# EAGLE design four-meters-usb-c-three-page (EAGLE 7.7.0)

## Sheet 1 of 3
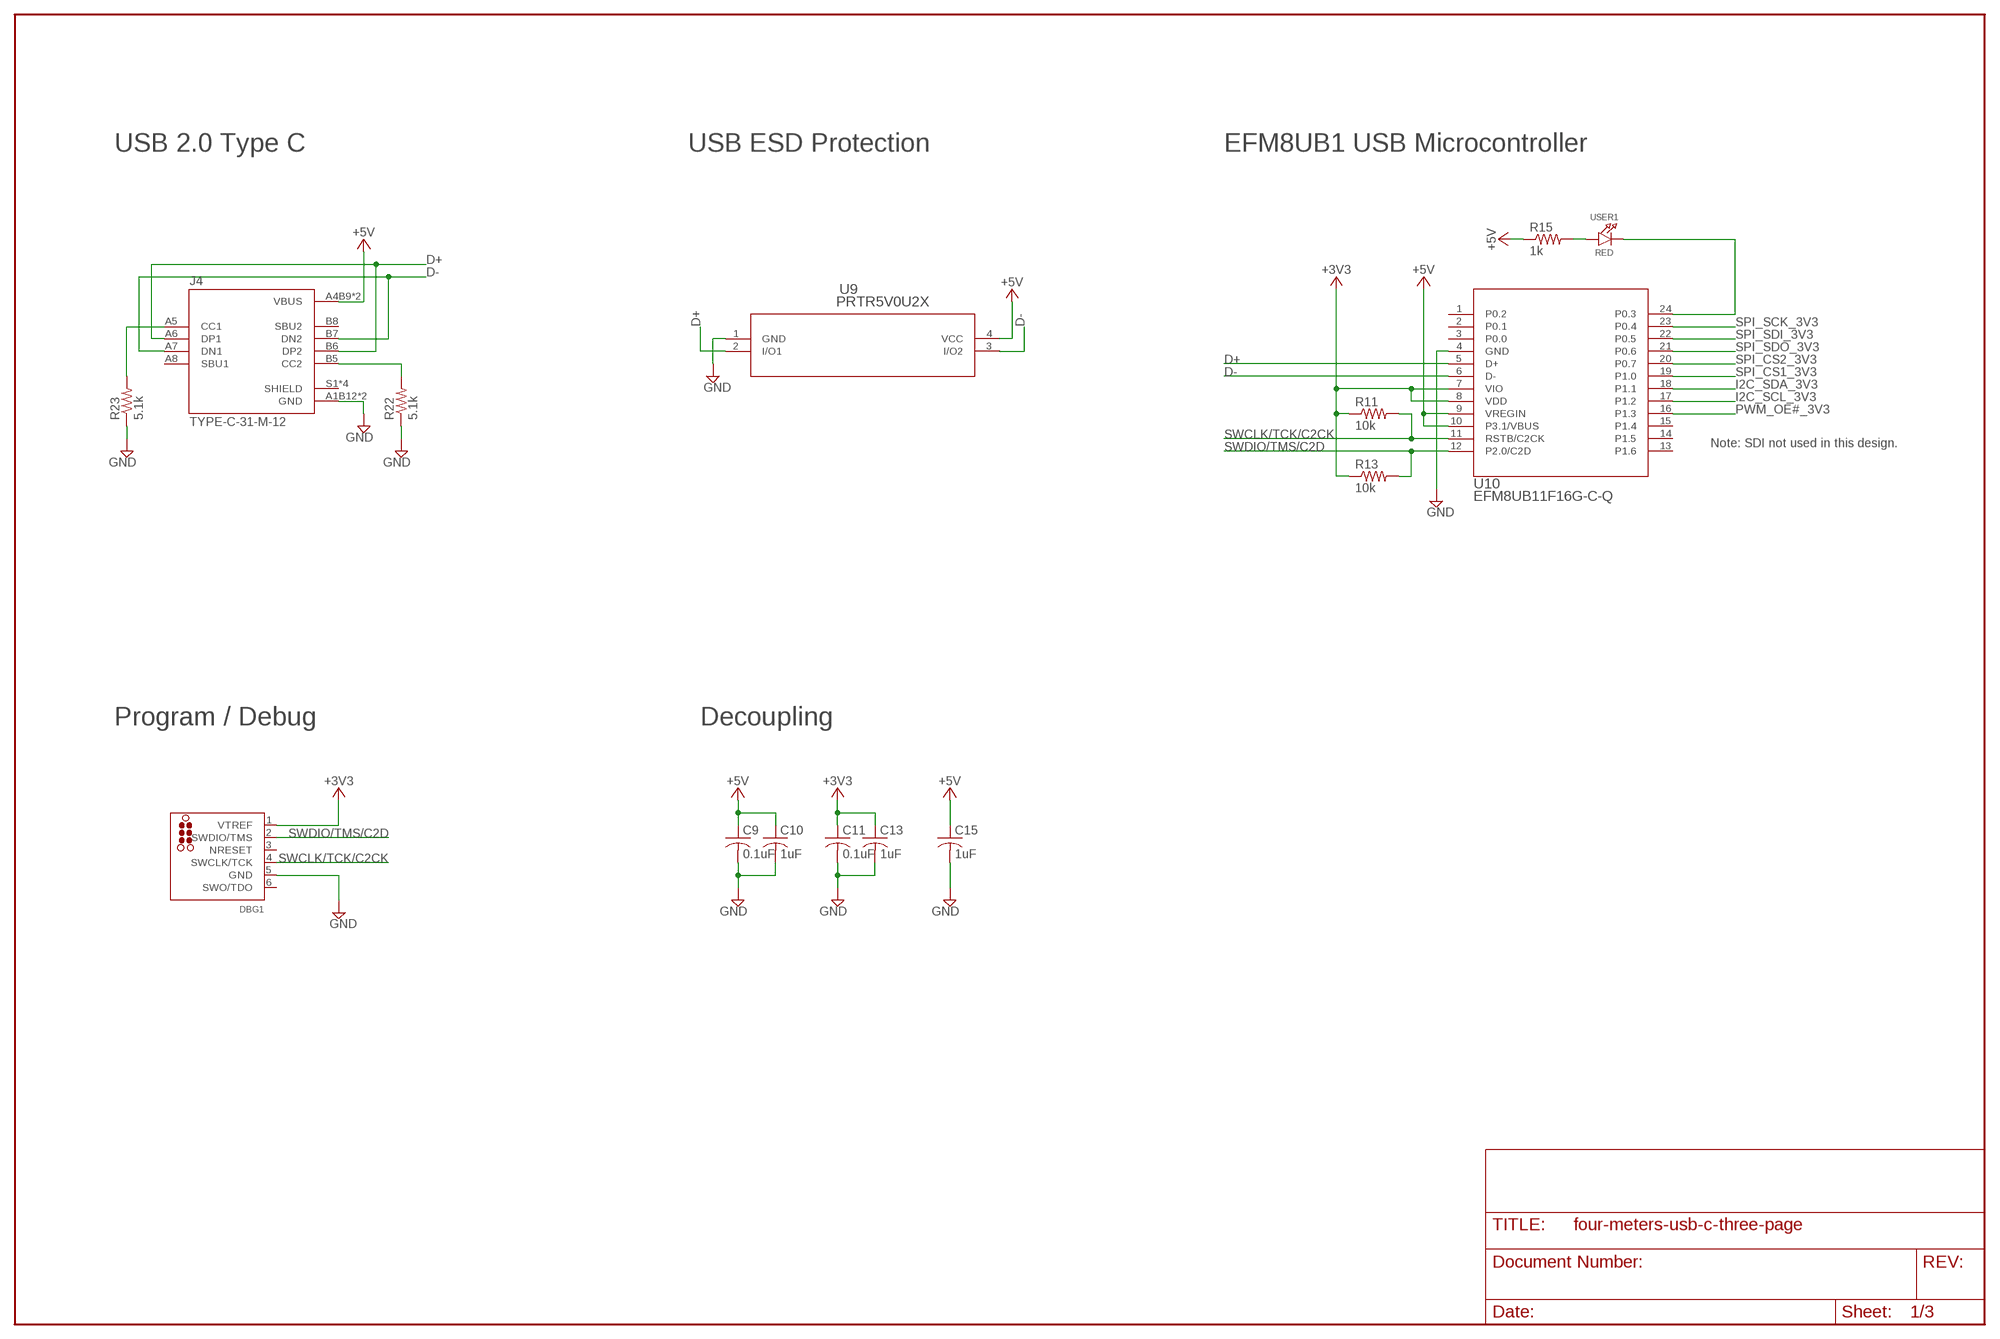
[diagram p0: schematic, sheet 1]

### Parts
C9  0.1uF  C-USC0603  [C0603]
C10  1uF  C-USC0603  [C0603]
C11  0.1uF  C-USC0603  [C0603]
C13  1uF  C-USC0603  [C0603]
C15  1uF  C-USC1210K  [C1210K]
DBG1  TC2030-CTX-SWD  [TC2030-MCP-NL]
J4  TYPE-C-31-M-12  [HRO_TYPE-C-31-M-12]
R11  10k  R-US_R0603  [R0603]
R13  10k  R-US_R0603  [R0603]
R15  1k  R-US_R0603  [R0603]
R22  5.1k  R-US_R0603  [R0603]
R23  5.1k  R-US_R0603  [R0603]
U9  PRTR5V0U2X  [SOT143B]
U10  EFM8UB11F16G-C-Q  [QSOP24]
USER1  RED  LED0805_NOOUTLINE  [CHIPLED_0805_NOOUTLINE]

### Nets
+3V3: C11.1 C13.1 DBG1.1(VTREF) R11.1 R13.1 U10.7(VIO) U10.8(VDD) ; also sheet 2,3
+5V: C9.1 C10.1 C15.1 J4.A4B9(VBUS) J4.B4A9(VBUS) R15.1 U9.4(VCC) U10.9(VREGIN) U10.10(P3.1/VBUS) ; also sheet 2,3
D+: J4.A6(DP1) J4.B6(DP2) U9.2(I/O1) U10.5(D+)
D-: J4.A7(DN1) J4.B7(DN2) U9.3(I/O2) U10.6(D-)
GND: C9.2 C10.2 C11.2 C13.2 C15.2 DBG1.5(GND) J4.A1B12(GND) J4.B1A12(GND) R22.1 R23.1 U9.1(GND) U10.4(GND) ; also sheet 2,3
I2C_SCL_3V3: U10.17(P1.2) ; also sheet 3
I2C_SDA_3V3: U10.18(P1.1) ; also sheet 3
LED1: U10.24(P0.3) USER1.C
N$17: R15.2 USER1.A
N$18: J4.B5(CC2) R22.2
N$19: J4.A5(CC1) R23.2
PWM_OE#_3V3: U10.16(P1.3) ; also sheet 3
SPI_CS1_3V3: U10.19(P1.0) ; also sheet 2
SPI_CS2_3V3: U10.20(P0.7) ; also sheet 2
SPI_SCK_3V3: U10.23(P0.4) ; also sheet 2
SPI_SDI_3V3: U10.22(P0.5)
SPI_SDO_3V3: U10.21(P0.6) ; also sheet 2
SWCLK/TCK/C2CK: DBG1.4(SWCLK/TCK) R11.2 U10.11(RSTB/C2CK)
SWDIO/TMS/C2D: DBG1.2(SWDIO/TMS) R13.2 U10.12(P2.0/C2D)
Unconnected: DBG1.6(SWO/TDO) J4.A8(SBU1) J4.B8(SBU2) J4.S1(SHIELD) J4.S2(SHIELD) J4.S3(SHIELD) J4.S4(SHIELD) U10.1(P0.2) U10.2(P0.1) U10.3(P0.0) U10.13(P1.6) U10.14(P1.5) U10.15(P1.4)

### Notes on the sheet
- USB 2.0 Type C | USB ESD Protection | EFM8UB1 USB Microcontroller
- Note: SDI not used in this design.
- Program / Debug | Decoupling

## Sheet 2 of 3
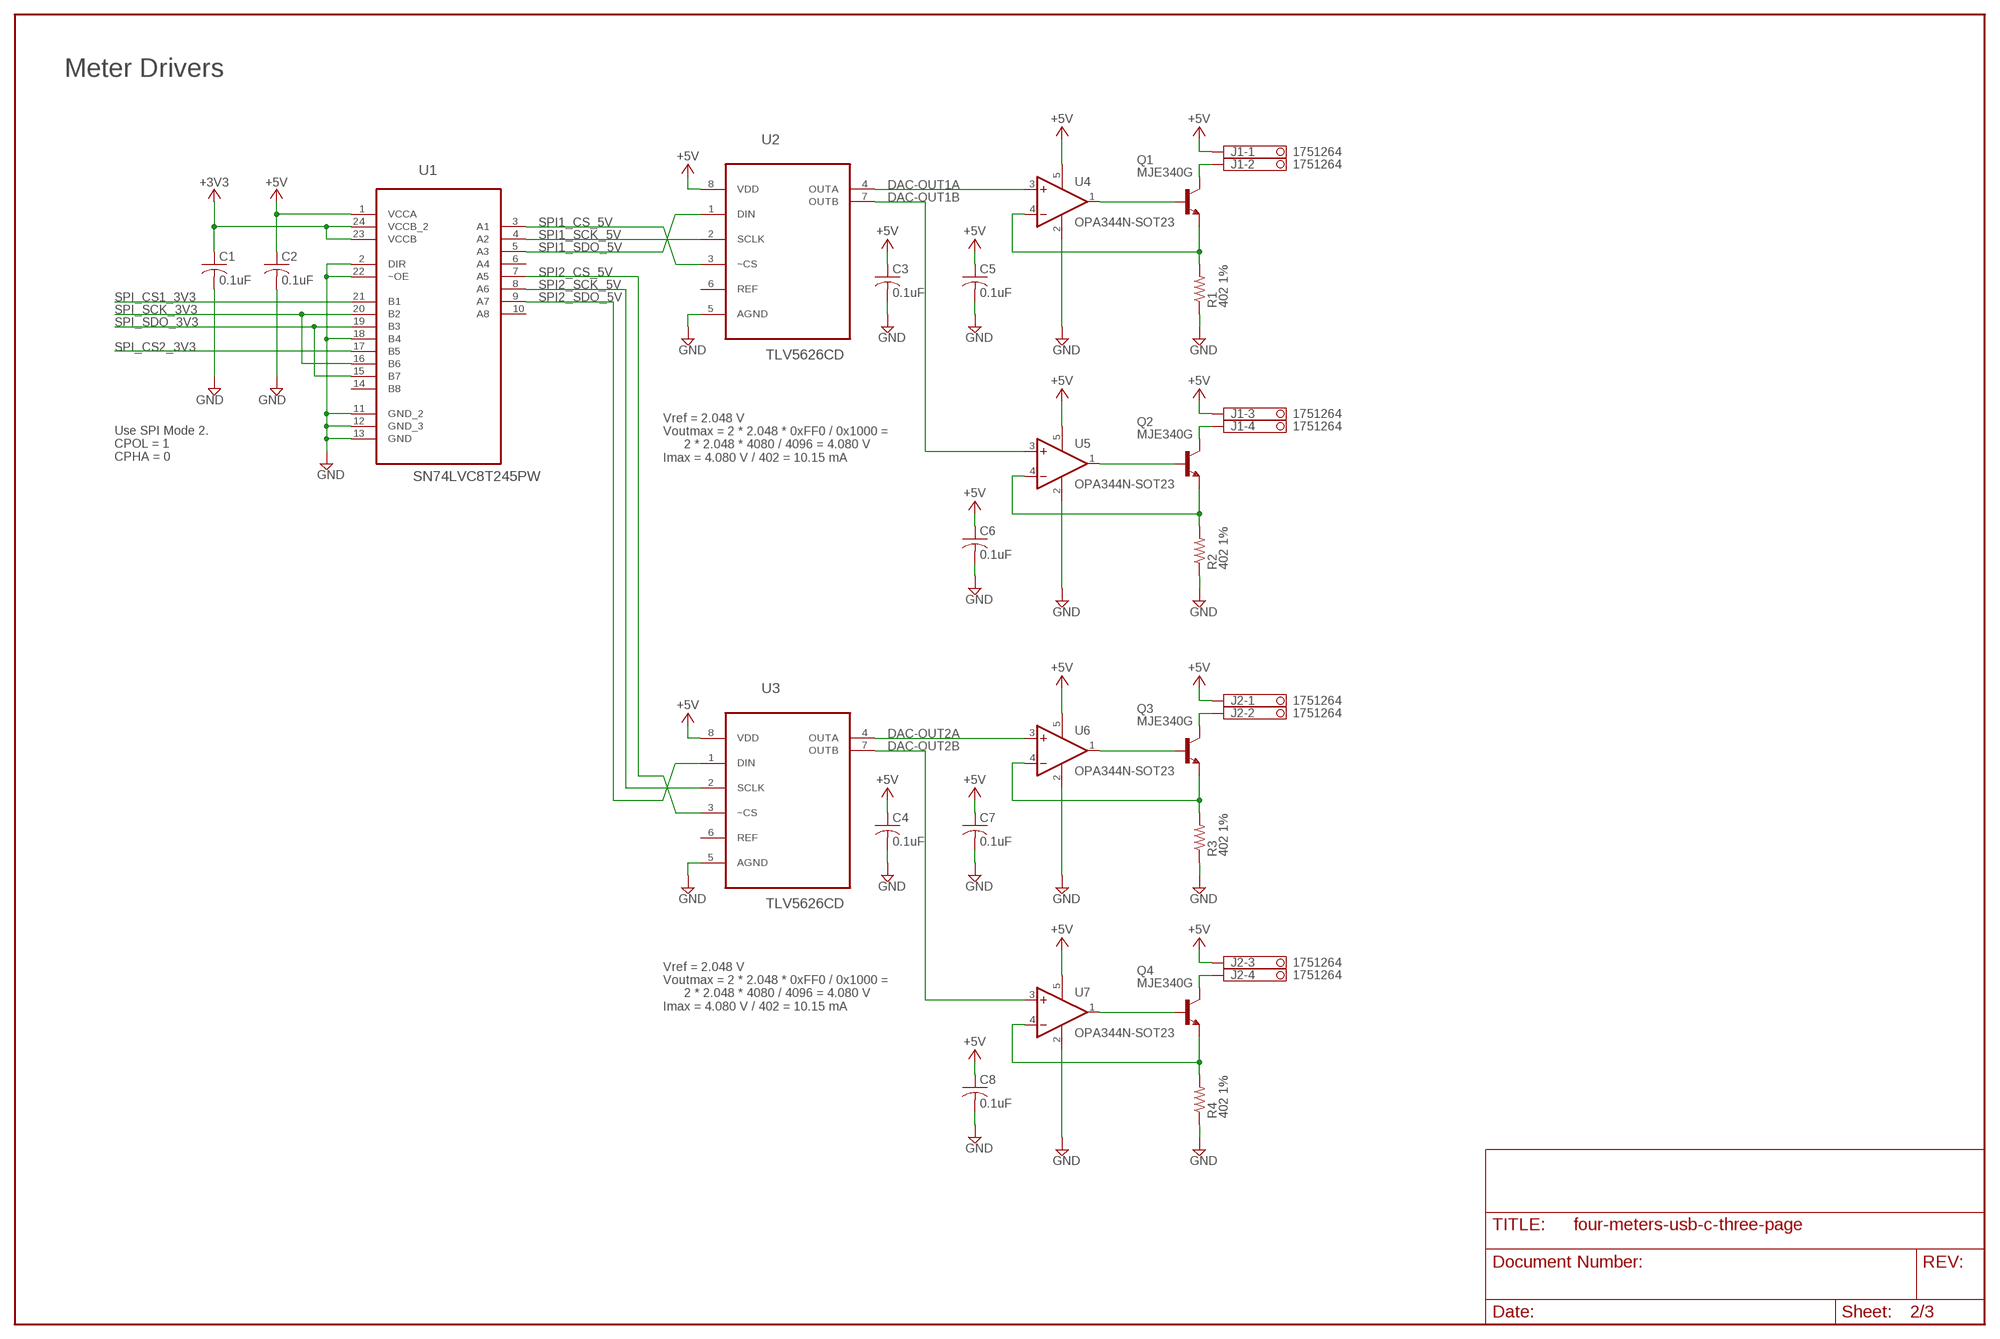
[diagram p1: schematic, sheet 2]

### Parts
C1  0.1uF  C-USC0603K  [C0603K]
C2  0.1uF  C-USC0603K  [C0603K]
C3  0.1uF  C-USC0603K  [C0603K]
C4  0.1uF  C-USC0603K  [C0603K]
C5  0.1uF  C-USC0603K  [C0603K]
C6  0.1uF  C-USC0603K  [C0603K]
C7  0.1uF  C-USC0603K  [C0603K]
C8  0.1uF  C-USC0603K  [C0603K]
J1  1751264  [1751264]
J2  1751264  [1751264]
Q1  MJE340G  -NPN-TO126V  [TO126V]
Q2  MJE340G  -NPN-TO126V  [TO126V]
Q3  MJE340G  -NPN-TO126V  [TO126V]
Q4  MJE340G  -NPN-TO126V  [TO126V]
R1  402 1%  R-US_R1210  [R1210]
R2  402 1%  R-US_R1210  [R1210]
R3  402 1%  R-US_R1210  [R1210]
R4  402 1%  R-US_R1210  [R1210]
U1  SN74LVC8T245PW  SN74AVC8T245PW  [SOP65P640X120-24N]
U2  TLV5626CD  [SOIC127P600X175-8N]
U3  TLV5626CD  [SOIC127P600X175-8N]
U4  OPA344N-SOT23  [SOT23-5]
U5  OPA344N-SOT23  [SOT23-5]
U6  OPA344N-SOT23  [SOT23-5]
U7  OPA344N-SOT23  [SOT23-5]

### Nets
+3V3: C1.1 U1.23(VCCB) U1.24(VCCB_2) ; also sheet 1,3
+5V: C2.1 C3.1 C4.1 C5.1 C6.1 C7.1 C8.1 J1.1 J1.3 J2.1 J2.3 U1.1(VCCA) U2.8(VDD) U3.8(VDD) U4.5(V+) U5.5(V+) U6.5(V+) U7.5(V+) ; also sheet 1,3
DAC-OUT1A: U2.4(OUTA) U4.3(+IN)
DAC-OUT1B: U2.7(OUTB) U5.3(+IN)
DAC-OUT2A: U3.4(OUTA) U6.3(+IN)
DAC-OUT2B: U3.7(OUTB) U7.3(+IN)
GND: C1.2 C2.2 C3.2 C4.2 C5.2 C6.2 C7.2 C8.2 R1.1 R2.1 R3.1 R4.1 U1.2(DIR) U1.11(GND_2) U1.12(GND_3) U1.13(GND) U1.18(B4) U1.22(~OE) U2.5(AGND) U3.5(AGND) U4.2(V-) U5.2(V-) U6.2(V-) U7.2(V-) ; also sheet 1,3
N$1: Q1.1(E) R1.2 U4.4(-IN)
N$2: Q3.1(E) R3.2 U6.4(-IN)
N$3: Q1.3(B) U4.1(OUT)
N$4: Q3.3(B) U6.1(OUT)
N$5: Q4.1(E) R4.2 U7.4(-IN)
N$6: Q4.3(B) U7.1(OUT)
N$10: Q2.1(E) R2.2 U5.4(-IN)
N$12: Q2.3(B) U5.1(OUT)
OUT1A: J1.2 Q1.2(C)
OUT1B: J1.4 Q2.2(C)
OUT2A: J2.2 Q3.2(C)
OUT2B: J2.4 Q4.2(C)
SPI1_CS_5V: U1.3(A1) U2.3(~CS)
SPI1_SCK_5V: U1.4(A2) U2.2(SCLK)
SPI1_SDO_5V: U1.5(A3) U2.1(DIN)
SPI2_CS_5V: U1.7(A5) U3.3(~CS)
SPI2_SCK_5V: U1.8(A6) U3.2(SCLK)
SPI2_SDO_5V: U1.9(A7) U3.1(DIN)
SPI_CS1_3V3: U1.21(B1) ; also sheet 1
SPI_CS2_3V3: U1.17(B5) ; also sheet 1
SPI_SCK_3V3: U1.16(B6) U1.20(B2) ; also sheet 1
SPI_SDO_3V3: U1.15(B7) U1.19(B3) ; also sheet 1
Unconnected: U1.6(A4) U1.10(A8) U1.14(B8) U2.6(REF) U3.6(REF)

### Notes on the sheet
- Meter Drivers
- Vref = 2.048 V
  Voutmax = 2 * 2.048 * 0xFF0 / 0x1000 = 
        2 * 2.048 * 4080 / 4096 = 4.080 V
  Imax = 4.080 V / 402 = 10.15 mA
- Use SPI Mode 2.
  CPOL = 1
  CPHA = 0
- Vref = 2.048 V
  Voutmax = 2 * 2.048 * 0xFF0 / 0x1000 = 
        2 * 2.048 * 4080 / 4096 = 4.080 V
  Imax = 4.080 V / 402 = 10.15 mA

## Sheet 3 of 3
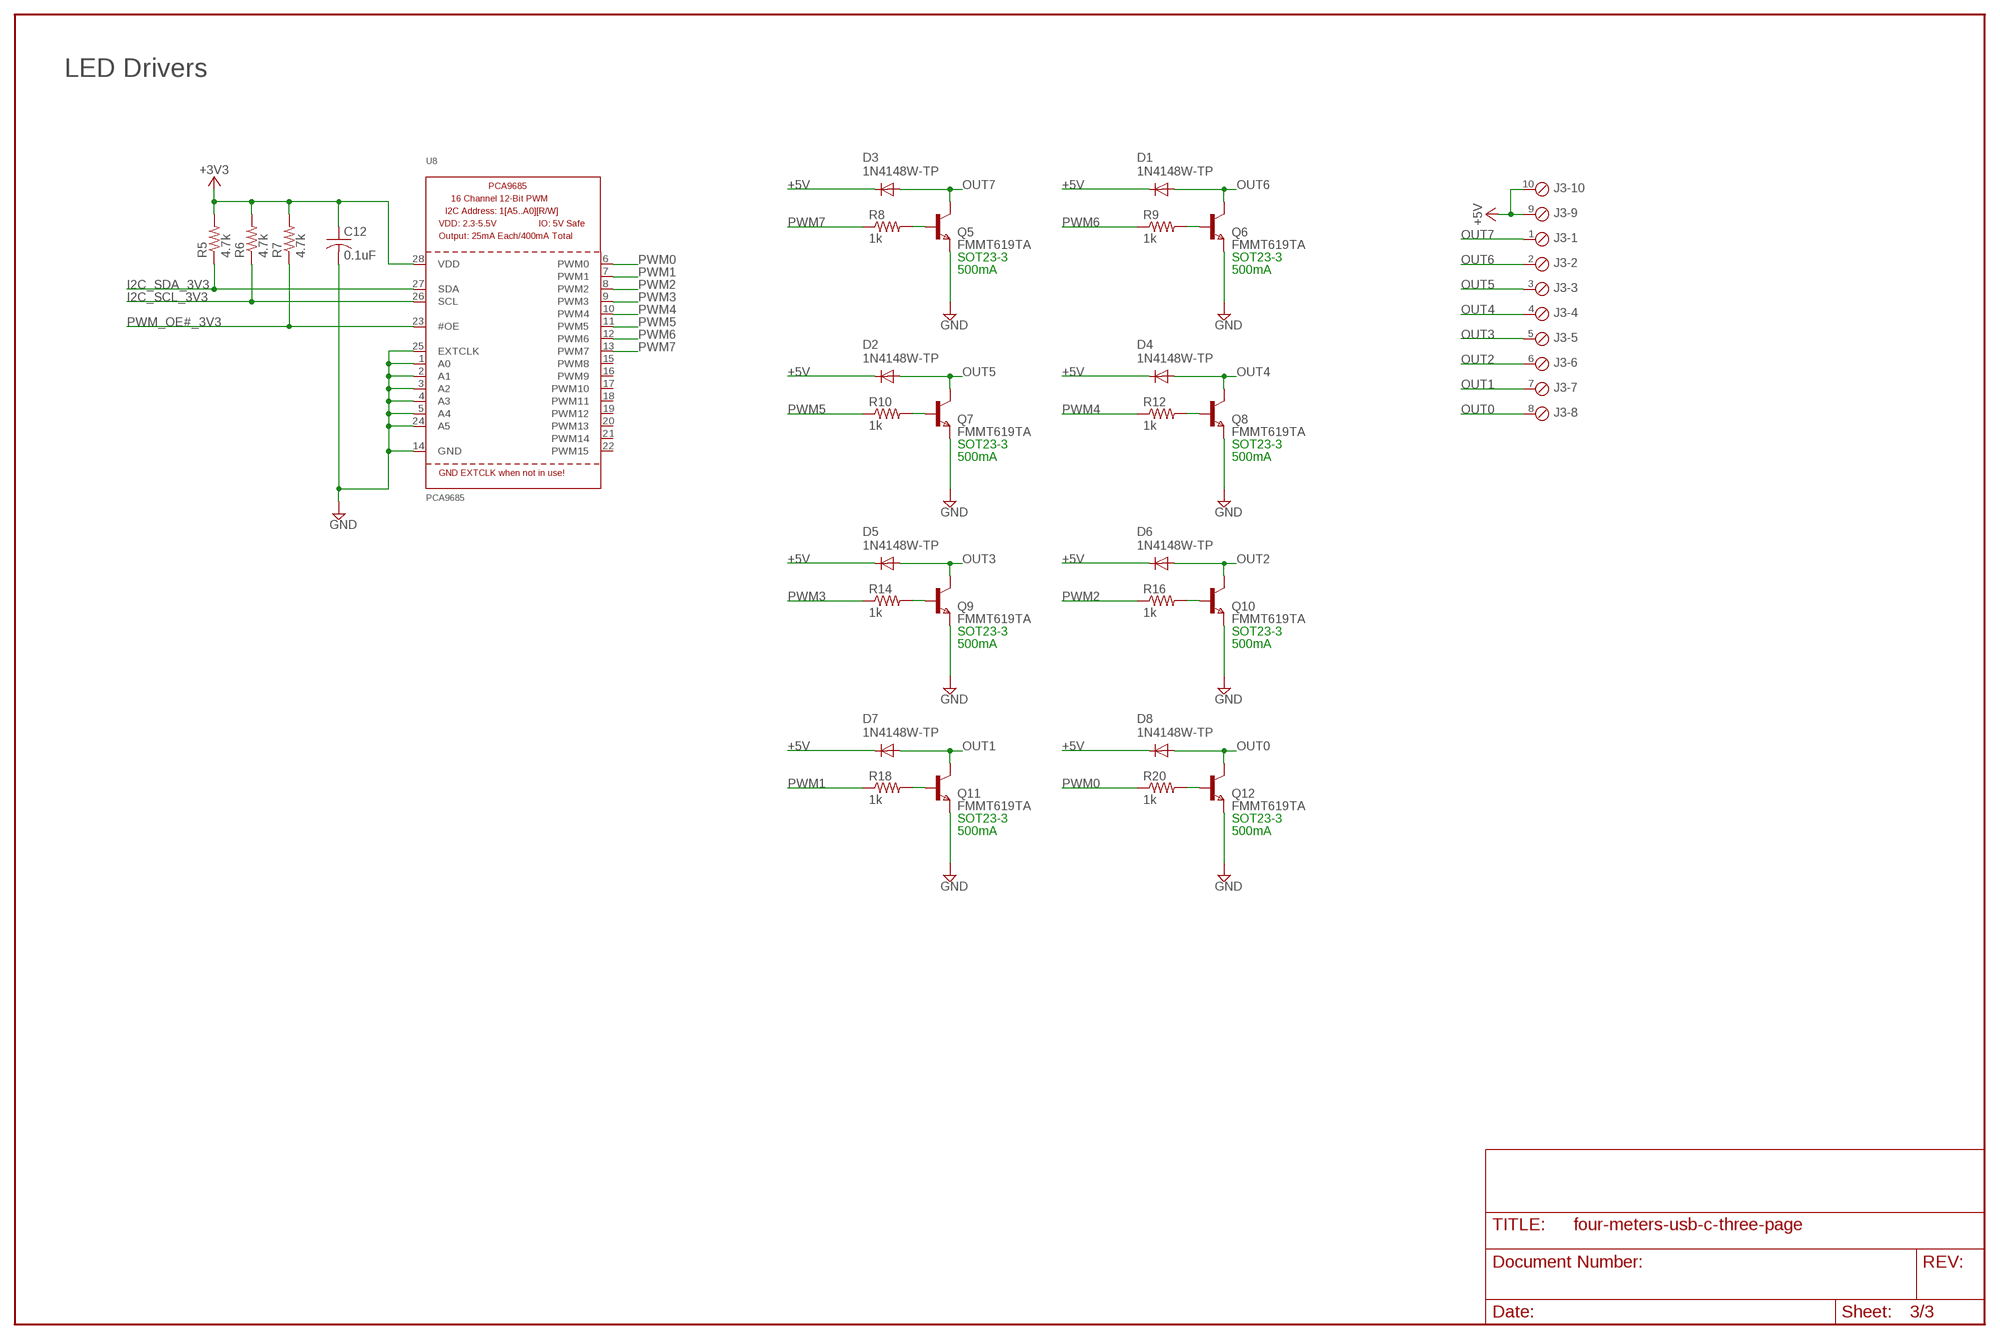
[diagram p2: schematic, sheet 3]

### Parts
C12  0.1uF  C-USC0603K  [C0603K]
D1  1N4148W-TP  DIODE-SOD123  [SOD123]
D2  1N4148W-TP  DIODE-SOD123  [SOD123]
D3  1N4148W-TP  DIODE-SOD123  [SOD123]
D4  1N4148W-TP  DIODE-SOD123  [SOD123]
D5  1N4148W-TP  DIODE-SOD123  [SOD123]
D6  1N4148W-TP  DIODE-SOD123  [SOD123]
D7  1N4148W-TP  DIODE-SOD123  [SOD123]
D8  1N4148W-TP  DIODE-SOD123  [SOD123]
J3  MPT10  [10POL254]
Q5  FMMT619TA  NPNSOT23  [SOT-23]
Q6  FMMT619TA  NPNSOT23  [SOT-23]
Q7  FMMT619TA  NPNSOT23  [SOT-23]
Q8  FMMT619TA  NPNSOT23  [SOT-23]
Q9  FMMT619TA  NPNSOT23  [SOT-23]
Q10  FMMT619TA  NPNSOT23  [SOT-23]
Q11  FMMT619TA  NPNSOT23  [SOT-23]
Q12  FMMT619TA  NPNSOT23  [SOT-23]
R5  4.7k  R-US_R0603  [R0603]
R6  4.7k  R-US_R0603  [R0603]
R7  4.7k  R-US_R0603  [R0603]
R8  1k  R-US_R0603  [R0603]
R9  1k  R-US_R0603  [R0603]
R10  1k  R-US_R0603  [R0603]
R12  1k  R-US_R0603  [R0603]
R14  1k  R-US_R0603  [R0603]
R16  1k  R-US_R0603  [R0603]
R18  1k  R-US_R0603  [R0603]
R20  1k  R-US_R0603  [R0603]
U8  PCA9685  [TSSOP28]

### Nets
+3V3: C12.1 R5.2 R6.2 R7.2 U8.28(VDD) ; also sheet 1,2
+5V: D1.C D2.C D3.C D4.C D5.C D6.C D7.C D8.C J3.9 J3.10 ; also sheet 1,2
GND: C12.2 Q5.2(E) Q6.2(E) Q7.2(E) Q8.2(E) Q9.2(E) Q10.2(E) Q11.2(E) Q12.2(E) U8.1(A0) U8.2(A1) U8.3(A2) U8.4(A3) U8.5(A4) U8.14(GND) U8.24(A5) U8.25(EXTCLK) ; also sheet 1,2
I2C_SCL_3V3: R6.1 U8.26(SCL) ; also sheet 1
I2C_SDA_3V3: R5.1 U8.27(SDA) ; also sheet 1
N$7: Q6.3(B) R9.2
N$8: Q7.3(B) R10.2
N$9: Q8.3(B) R12.2
N$11: Q9.3(B) R14.2
N$13: Q10.3(B) R16.2
N$14: Q11.3(B) R18.2
N$15: Q12.3(B) R20.2
N$16: Q5.3(B) R8.2
OUT0: D8.A J3.8 Q12.1(C)
OUT1: D7.A J3.7 Q11.1(C)
OUT2: D6.A J3.6 Q10.1(C)
OUT3: D5.A J3.5 Q9.1(C)
OUT4: D4.A J3.4 Q8.1(C)
OUT5: D2.A J3.3 Q7.1(C)
OUT6: D1.A J3.2 Q6.1(C)
OUT7: D3.A J3.1 Q5.1(C)
PWM0: R20.1 U8.6(PWM0)
PWM1: R18.1 U8.7(PWM1)
PWM2: R16.1 U8.8(PWM2)
PWM3: R14.1 U8.9(PWM3)
PWM4: R12.1 U8.10(PWM4)
PWM5: R10.1 U8.11(PWM5)
PWM6: R9.1 U8.12(PWM6)
PWM7: R8.1 U8.13(PWM7)
PWM_OE#_3V3: R7.1 U8.23(#OE) ; also sheet 1
Unconnected: U8.15(PWM8) U8.16(PWM9) U8.17(PWM10) U8.18(PWM11) U8.19(PWM12) U8.20(PWM13) U8.21(PWM14) U8.22(PWM15)

### Notes on the sheet
- LED Drivers
- SOT23-3 | SOT23-3
- 500mA | 500mA
- SOT23-3 | SOT23-3
- 500mA | 500mA
- SOT23-3 | SOT23-3
- 500mA | 500mA
- SOT23-3 | SOT23-3
- 500mA | 500mA

## Power pins joined to a net without a drawn wire
NRESET: DBG1.3(NRESET)

## Library data of the parts
C1-C8 C12 = rcl:C-US: CAPACITOR, American symbol; MFR: KEMET; MFR_PART_NO: C1206C104K5RACAUTO
C9-C11 C13 C15 = rcl:C-US: CAPACITOR, American symbol
D1-D8 = diode:DIODE-: DIODE
DBG1 = tag-connect:TC2030-CTX-SWD
J1 J2 = con-phoenix-350:1751264: MKDS 1/ 4-3,5 Printklemme Nennstrom: 10 A Bemessungsspannung: 160 V Raster: 3,5 mm Polzahl: 4 Montageart: Löten Anschlussart: Schraubanschluss Anschlussrichtung vom Leiter zur Platine: 0° Source: http://eshop.phoenixcontact.com .. 1751264.pdf; MPN: 1751264; OC_FARNELL: unknown; OC_NEWARK: 10R0934
J3 = con-phoenix-254:MPT10: PHOENIX CONNECTOR; OC_FARNELL: unknown; OC_NEWARK: unknown
J4 = TYPE-C-31-M-12-OSHPARK:TYPE-C-31-M-12: USB Connectors 24 Receptacle 1 8.94*7.3mm RoHS; AVAILABILITY: Unavailable; DESCRIPTION: USB Connectors 24 Receptacle 1 8.94*7.3mm RoHS; MF: HRO Electronics Co., Ltd.; MP: TYPE-C-31-M-12; PACKAGE: Package; PRICE: None
Q1-Q4 = transistor:*-NPN-: NPN Transistror BF959 corrected 2008.03.06; MFR: ON SEMI; MFR_PART_NO: MJE340G
Q5-Q12 = zetex:NPNSOT23: NPN TRANSISTOR; MPN: DSS20201L-7; OC_FARNELL: 1710688; OC_NEWARK: 25R4555
R1-R4 = rcl:R-US_: RESISTOR, American symbol; MFR: PANASONIC; MFR_PART_NO: ERJ-14NF73R2U
R5-R14 R16 R18 R20 R22 R23 = rcl:R-US_: RESISTOR, American symbol
R15 = resistor:R-US_: RESISTOR, American symbol
U1 = Texas Instruments_By_element14_Batch_1:SN74AVC8T245PW: TRANSCEIVER; MFR: TI; MFR_PART_NO: SN74LVC8T245PW; MPN: SN74AVC8T245PW; OC_FARNELL: 1053490; OC_NEWARK: 10J9626; PACKAGE: TSSOP-24; SUPPLIER: Texas Instruments
U2 U3 = Texas Instruments_By_element14_Batch_1:TLV5626CD: 2.7-V TO 5.5-V LOW-POWER DUAL 8-BIT DIGITAL-TO-ANALOG CONVERTER WITH INTERNAL REFERENCE AND POWER DOWN; MFR: TI; MFR_PART_NO: TLV5626CD; MPN: TLV5626CD; OC_FARNELL: 4512819; OC_NEWARK: 19C9016; PACKAGE: SOIC-8; SUPPLIER: Texas Instruments
U4-U7 = linear:OPA*-SOT23: Single Operational Amplifier Low Power, Single-Supply, Rail-To-Rail Operational Amplifier Source: http://focus.ti.com/lit/ds/symlink/opa2345.pdf; MFR: TI; MFR_PART_NO: OPA344NA/3K
U8 = microbuilder:PCA9685: PCA9685 - 16 Channel 12-Bit I2C PWM Controller 5.0V tolerant 16 channel, 12-bit I2C PWM controller with 25mA per output (max. 400mA total) Digikey: 568-5931-1-ND
U9 = Nexperia_PRTR5V0U2X,215:PRTR5V0U2X; MANUFACTURER_PART_NUMBER: PRTR5V0U2X; VENDOR: NXP
U10 = EFM8UB11F16G-C-QSOP24:EFM8UB11F16G-C-Q; MANUFACTURER_PART_NUMBER: efm8ub11f16gbqsop24; VENDOR: Silicon Labs
USER1 = microbuilder:LED: LED 0603 - 0603 Surface Mount Package 2mA: Green LED - Low Power (3.9mcd, 2ma, 1.7Vf) - Digikey: 475-2709-2-ND Orange LED - Low Power (9.8mcd, 2ma, 1.8Vf) - Digikey: 475-1194-2-ND Red LED - Low Power (5mcd, 2ma, 1.8Vf) - Digikey: 475-1195-2-ND Yellow LED - Low Power (7mcd, 2ma, 1.8Vf) - Digikey: 475-1196-2-ND 5mA: Blue LED - Low Power (17mcd, 5ma, 2.9Vf) - Digikey: LNJ937W8CRACT-ND 0805 - 0805 Surface Mount Package 2mA: Red LED (8.8mcd, 2mA, 1.8Vf, Clear) - Low Power [Digikey: 475-2510-1-ND] Green LED (5mcd, 2mA, 1.8Vf, Clear) - Low Power [Digikey: 475-2730-1-ND] Yellow LED (11.3mcd, 2mA, 1.8Vf, Clear) - Low Power [Digikey: 475-2555-1-ND] 20mA: Red LED (104mcd, 20mA, Diffused) - LS R976 [Digikey: 475-1278-6-ND] Red LED (12mcd, 20mA, 2.0Vf, Clear) - APT2012EC [Digikey: 754-1128-1-ND] Green LED (15mcd, 20mA, 2.2Vf, Clear) - APT2012GC [Digikey: 754-1131-1-ND] Orange LED (160mcd, 20mA, 2.1Vf, Clear) - APT2012SECK [Digikey: 754-1130-1-ND] 1206 - 1206 Surface Mount Package Green LED (26mcd, 20mA, Diffused) - LG N971 [Digikey: 475-1407-6-ND] Red LED (15mcd, 20mA, Diffused) - LH N974 [Digikey: 475-1416-6-ND] Cree - Cree High-Power Surface Mount LEDs XPEBWT-L1-0000-00D50 - White 111lm 350mA 2.9Vf 6200K 110° XTEAWT-00-0000-00000LEE3 - White 114lm 350mA 2.85Vf 5000K 115° Everlight - Everlight 45-21 Series Surface Mount LEDs 45-21/QK2C-B2832AC2CB2/2T - Warm White 2000mcd 20mA 3.25Vf 3050K 120° 45-21/LK2C-B38452C4CB2/2T - Nuetral White 2000mcd 20mA 3.25Vf 4150K 120° 45-21/LK2C-B50634C6CB2/2T - Cold White 2200mcd 20mA 3.25Vf 5650K 120° PLCC2 Reverse Mount LS T77K-J1L2-1-0-2-R18-Z - Red 11.25mcd 2mA 1.8Vf 630nm 120° LO T77K-L1M2-24-Z - Orange 19.6mcd 2mA 1.8Vf 606nm 120° LY T77K-K2M1-26-Z - Yellow 15.7mcd 2mA 1.8Vf 587nm 120°

## Board
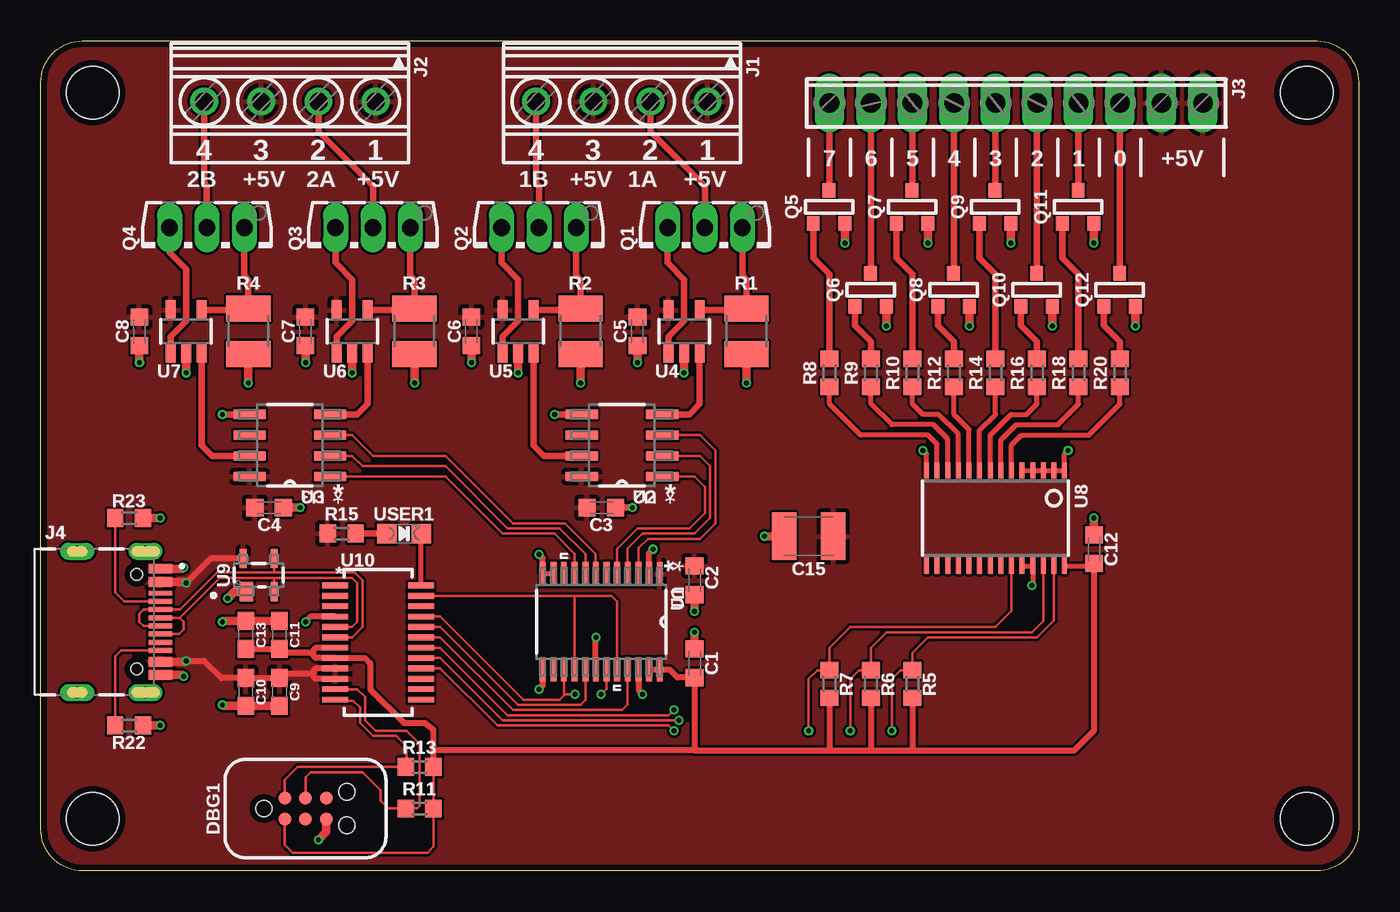
[diagram p3: board, top side]
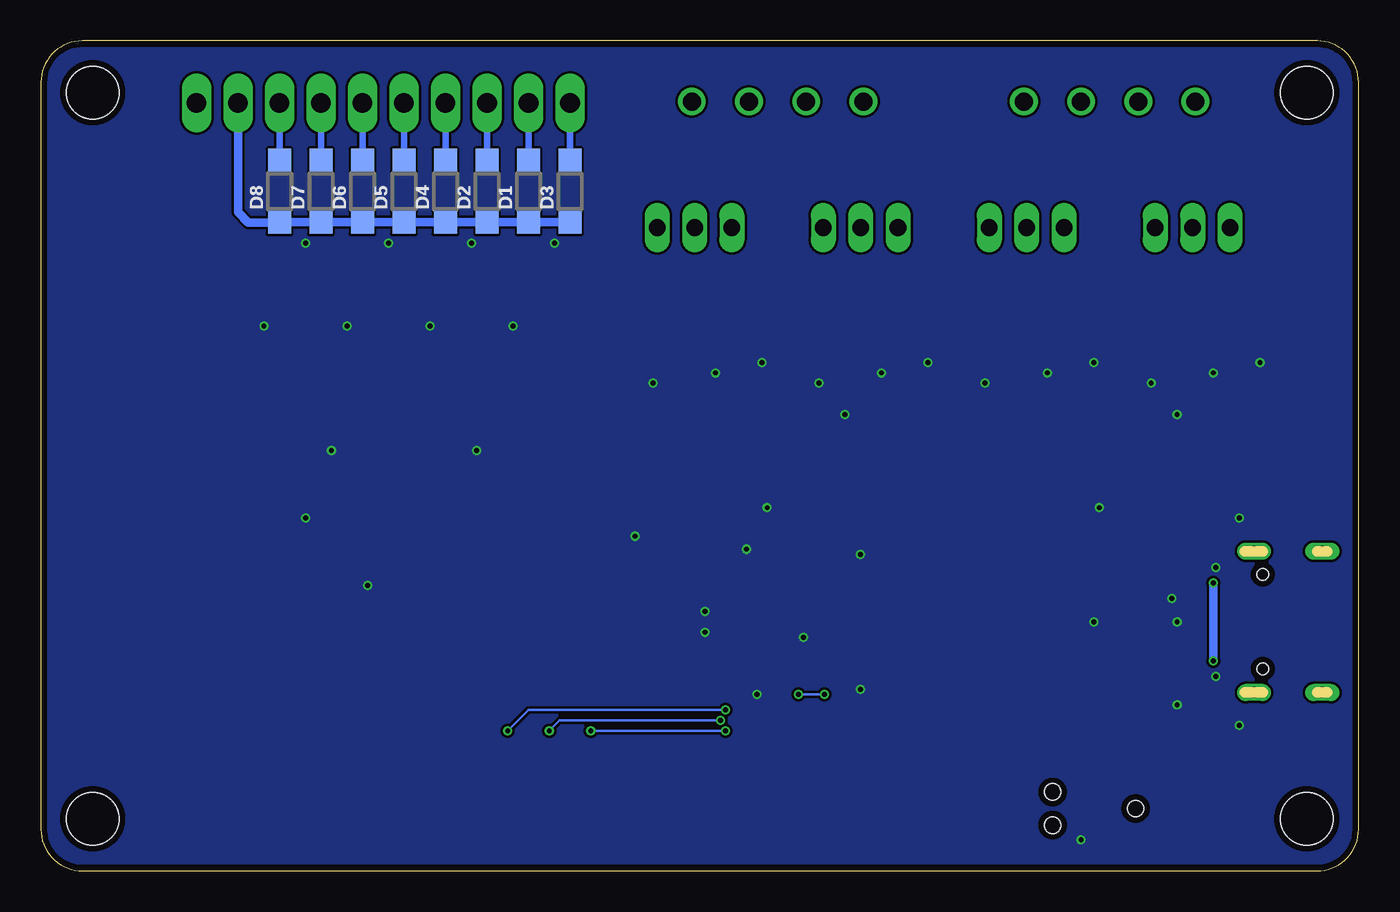
[diagram p4: board, bottom side, seen from below]

Size 80.64 x 50.8 mm. Coordinates in mm from the lower left corner, seen from the top.
Outline: 0,48.26 arc-90 2.54,50.8 78.11,50.8 arc-90 80.64,48.26 80.64,2.54 arc-90 78.11,0 2.54,0 arc-90 0,2.54 0,48.26
Copper layers (1*16): Top 0.035559375mm / dielectric 1.6mm / Bottom 0.035559375mm
Design rules "oshpark-2layer-2018": minimum track width 6mil, minimum drill 10mil, track to track 6mil, track to pad 6mil, pad to pad 6mil, via to via 6mil, smd to smd 6mil, copper to edge 15mil, drill to drill 6mil, minimum pad ring 5mil, minimum via ring 5mil, stop-mask expansion 2.5mil, vias tented up to drill 0mil, thermal gap 10mil
Holes 3.2 mm at 3.17,47.62 77.47,47.62 3.17,3.17 77.47,3.17

### Footprints (pad centres in the part's own frame; a part is rotated, then mirrored left to right if it is on the bottom)
C0603K = smd 1.05 x 1.08: 1 -0.875,0; 2 0.875,0
C0603 = smd 1.1 x 1: 1 -0.85,0; 2 0.85,0
C1210K = smd 1.5 x 2.9: 1 -1.5,0; 2 1.5,0
SOD123 = smd 1.4 x 1.4: A 1.9,0; C -1.9,0
TC2030-MCP-NL = smd 0.787 x 0.787: 1 1.27,-0.635; 2 1.27,0.635; 3 2.54,-0.635; 4 2.54,0.635; 5 3.81,-0.635; 6 3.81,0.635 | hole 0.991: 0,0; 5.08,-1.016; 5.08,1.016
1751264 = drill 1.1 pad 1.7: 1 -5.25,-0.1; 2 -1.75,-0.1; 3 1.75,-0.1; 4 5.25,-0.1
10POL254 = drill 1.2 long: 1 -11.43,0; 2 -8.89,0; 3 -6.35,0; 4 -3.81,0; 5 -1.27,0; 6 1.27,0; 7 3.81,0; 8 6.35,0; 9 8.89,0; 10 11.43,0
HRO_TYPE-C-31-M-12 = smd 0.6 x 1.45: A1B12 -3.25,5.095; A4B9 -2.45,5.095; B1A12 3.25,5.095; B4A9 2.45,5.095 | smd 0.3 x 1.45: A5 -1.25,5.095; A6 -0.25,5.095; A7 0.25,5.095; A8 1.25,5.095; B5 1.75,5.095; B6 0.75,5.095; B7 -0.75,5.095; B8 -1.75,5.095 | drill 0.65 pad 1.05 long: S1 -4.32,4.18; S2 4.32,4.18; S3 -4.32,0; S4 4.32,0 | hole 0.7: -2.89,3.65; 2.89,3.65
TO126V = drill 1.016 long: 1 -2.286,-1.27; 2 0,-1.27; 3 2.286,-1.27
SOT-23 = smd 0.787 x 0.889: 1 0.025,-1.016; 2 -0.94,1.016; 3 0.991,1.016
R1210 = smd 1.6 x 2.7: 1 -1.4,0; 2 1.4,0
R0603 = smd 1 x 1.1: 1 -0.85,0; 2 0.85,0
SOP65P640X120-24N = smd 1.473 x 0.356: 1 -2.921,3.581; 2 -2.921,2.921; 3 -2.921,2.286; 4 -2.921,1.626; 5 -2.921,0.965; 6 -2.921,0.33; 7 -2.921,-0.33; 8 -2.921,-0.965; 9 -2.921,-1.626; 10 -2.921,-2.286; 11 -2.921,-2.921; 12 -2.921,-3.581; 13 2.921,-3.581; 14 2.921,-2.921; 15 2.921,-2.286; 16 2.921,-1.626; 17 2.921,-0.965; 18 2.921,-0.33; 19 2.921,0.33; 20 2.921,0.965; 21 2.921,1.626; 22 2.921,2.286; 23 2.921,2.921; 24 2.921,3.581
SOIC127P600X175-8N = smd 1.981 x 0.559: 1 -2.464,1.905; 2 -2.464,0.635; 3 -2.464,-0.635; 4 -2.464,-1.905; 5 2.464,-1.905; 6 2.464,-0.635; 7 2.464,0.635; 8 2.464,1.905
SOT23-5 = smd 0.6 x 1.2: 1 -0.95,-1.306; 2 0,-1.306; 3 0.95,-1.306; 4 0.95,1.306; 5 -0.95,1.306
TSSOP28 = smd 0.305 x 0.991: 1 -4.225,-2.918; 2 -3.575,-2.918; 3 -2.925,-2.918; 4 -2.275,-2.918; 5 -1.625,-2.918; 6 -0.975,-2.918; 7 -0.325,-2.918; 8 0.325,-2.918; 9 0.975,-2.918; 10 1.625,-2.918; 11 2.275,-2.918; 12 2.925,-2.918; 13 3.575,-2.918; 14 4.225,-2.918; 15 4.225,2.918; 16 3.575,2.918; 17 2.925,2.918; 18 2.275,2.918; 19 1.625,2.918; 20 0.975,2.918; 21 0.325,2.918; 22 -0.325,2.918; 23 -0.975,2.918; 24 -1.625,2.918; 25 -2.275,2.918; 26 -2.925,2.918; 27 -3.575,2.918; 28 -4.225,2.918
SOT143B = smd 0.838 x 1.168: 1 -0.747,-1.016 | smd 0.432 x 1.168: 2 0.95,-1.016; 3 0.95,1.016; 4 -0.95,1.016
QSOP24 = smd 1.6 x 0.35: 1 -2.625,3.493; 2 -2.625,2.857; 3 -2.625,2.223; 4 -2.625,1.587; 5 -2.625,0.953; 6 -2.625,0.318; 7 -2.625,-0.318; 8 -2.625,-0.953; 9 -2.625,-1.587; 10 -2.625,-2.223; 11 -2.625,-2.857; 12 -2.625,-3.493; 13 2.625,-3.493; 14 2.625,-2.857; 15 2.625,-2.223; 16 2.625,-1.587; 17 2.625,-0.953; 18 2.625,-0.318; 19 2.625,0.318; 20 2.625,0.953; 21 2.625,1.587; 22 2.625,2.223; 23 2.625,2.857; 24 2.625,3.493
CHIPLED_0805_NOOUTLINE = smd 1.2 x 1.2: A 0,-1.05; C 0,1.05

### Placement (x,y rotation side)
C1  40.01,12.7 90 top
C2  40.01,17.78 270 top
C3  34.29,22.23 0 top
C4  13.97,22.23 0 top
C5  36.51,33.02 270 top
C6  26.35,33.02 270 top
C7  16.19,33.02 270 top
C8  6.03,33.02 270 top
C9  14.61,10.95 270 top
C10  12.54,10.95 270 top
C11  14.61,14.45 90 top
C12  64.45,19.68 90 top
C13  12.54,14.45 90 top
C15  46.99,20.48 180 top
D1  50.8,41.59 90 bottom
D2  53.34,41.59 90 bottom
D3  48.26,41.59 90 bottom
D4  55.88,41.59 90 bottom
D5  58.42,41.59 90 bottom
D6  60.96,41.59 90 bottom
D7  63.5,41.59 90 bottom
D8  66.04,41.59 90 bottom
DBG1  13.65,3.81 0 top
J1  35.56,46.99 180 top
J2  15.24,46.99 180 top
J3  59.69,46.99 0 top
J4  2.22,15.24 270 top
Q1  40.64,38.1 180 top
Q2  30.48,38.1 180 top
Q3  20.32,38.1 180 top
Q4  10.16,38.1 180 top
Q5  48.26,40.64 180 top
Q6  50.8,35.56 180 top
Q7  53.34,40.64 180 top
Q8  55.88,35.56 180 top
Q9  58.42,40.64 180 top
Q10  60.96,35.56 180 top
Q11  63.5,40.64 180 top
Q12  66.04,35.56 180 top
R1  43.18,33.02 90 top
R2  33.02,33.02 90 top
R3  22.86,33.02 90 top
R4  12.7,33.02 90 top
R5  53.34,11.43 270 top
R6  50.8,11.43 270 top
R7  48.26,11.43 270 top
R8  48.26,30.48 90 top
R9  50.8,30.48 90 top
R10  53.34,30.48 90 top
R11  23.18,3.81 180 top
R12  55.88,30.48 90 top
R13  23.18,6.35 180 top
R14  58.42,30.48 90 top
R15  18.41,20.64 0 top
R16  60.96,30.48 90 top
R18  63.5,30.48 90 top
R20  66.04,30.48 90 top
R22  5.4,8.89 180 top
R23  5.4,21.59 180 top
U1  34.29,15.24 270 top
U2  35.56,26.04 180 top
U3  15.24,26.04 180 top
U4  39.37,33.02 0 top
U5  29.21,33.02 0 top
U6  19.05,33.02 0 top
U7  8.89,33.02 0 top
U8  58.42,21.59 180 top
U9  13.34,18.1 0 top
U10  20.64,13.97 0 top
USER1  22.23,20.64 270 top

### Tracks (layer width: path | path; a pad name or v marks a point on that pad's centre or on a via)
+3V3
  Top 0.152: R13.1 R11.1 24.03,1.49 23.65,1.11 15.4,1.11 14.92,1.59 DBG1.1
  Top 0.305: 14.71,13.34 C11.1 | U8.28 64.31,18.67
  Top 0.356: C13.1 C11.1 | U10.7 16.83,13.65 16.67,13.49 16.67,13.34 | 16.67,13.34 16.67,13.18 16.83,13.02 U10.8 19.84,13.02 20.16,12.7 20.16,11.11 22.23,9.05 23.5,9.05 24.03,8.63 24.03,7.3 | 16.67,13.34 14.71,13.34 | R13.1 24.03,7.3 | 40.01,7.36 48.26,7.36 | 48.26,7.36 50.8,7.36 | 50.8,7.36 53.34,7.36 | 53.34,7.36 63.24,7.36 64.45,8.57 C12.1 64.31,18.67 | U1.23 U1.24 38.48,12.32 38.98,11.82 C1.1 40.01,7.36 | R5.2 53.34,7.36 | R6.2 50.8,7.36 | R7.2 48.26,7.36 | 40.01,7.36 24.08,7.36 24.03,7.3
+5V  (via drill 0.3)
  Top 0.305: 15.03,12.06 C9.1
  Top 0.356: C9.1 C10.1 11.06,11.8 10,12.86 v8.89,12.86 | U10.9 16.83,12.38 16.67,12.22 16.67,12.06 | U10.10 16.83,11.75 16.67,11.91 16.67,12.06 | 16.67,12.06 15.03,12.06 | U9.4 10.38,19.11 v8.89,17.62
  Top 0.508: v8.89,17.62 8.82,17.69 J4.A4B9 | J4.B4A9 8.82,12.79 v8.89,12.86
  Bottom 0.406: D8.C
  Bottom 0.508: J3.9 68.58,40.32 67.94,39.69 D8.C | D8.C D7.C D6.C D5.C D4.C D2.C D1.C D3.C | v8.89,17.62 v8.89,12.86
  pour Top (isolate 0.152): 0,50.8 80.64,50.8 80.64,0 0,0
D+
  Top 0.152: J4.A6 8.48,15.49 | 8.48,15.49 8.73,15.24 8.73,14.76 8.46,14.49 J4.B6 | U9.2 14.29,17.94 | 8.48,15.49 8.51,15.49 | U10.5 19.05,14.92 19.37,15.24 19.37,17.62 19.05,17.94 14.29,17.94 | 8.48,15.49 10.93,17.94 14.29,17.94
D-
  Top 0.152: J4.A7 6.28,14.99 6.03,15.24 6.03,15.72 6.31,15.99 J4.B7 8.53,15.99 10.79,18.26 14.29,18.26 | U9.3 14.29,18.26 | U10.6 19.05,14.29 19.68,14.92 19.68,17.78 19.21,18.26 14.29,18.26
DAC-OUT1A
  Top 0.406: U4.3 40.32,28.57 39.69,27.94 U2.4
DAC-OUT1B
  Top 0.406: U5.3 30.16,26.04 30.8,25.4 U2.7
DAC-OUT2A
  Top 0.406: U6.3 20,28.57 19.37,27.94 U3.4
DAC-OUT2B
  Top 0.406: U7.3 9.84,26.04 10.48,25.4 U3.7
GND  (via drill 0.3)
  Top 0.305: U8.5 U8.4 U8.3 U8.2 U8.1 62.65,25.5 v62.87,25.72 | U8.14 54.2,25.5 v53.98,25.72 | U8.24 U8.25 60.7,17.52 v60.64,17.46 | 11.17,15.3 v11.11,15.24 | U1.11 U1.12
  Top 0.356: U10.4 16.51,15.56 v16.19,15.24 | U1.12 30.71,19.14 v30.48,19.37 | U1.13 30.71,11.34 v30.48,11.11 | U1.2 37.21,19.43 v37.47,19.68 | U1.22 36.58,11.05 v36.83,10.79 | U1.18 33.96,14.28 v33.97,14.29
  Top 0.406: C3.2 v36.2,22.23 | U3.5 v11.11,27.94 | U2.5 v31.43,27.94 | v49.2,38.43 v49.21,38.42 | v54.28,38.43 v54.29,38.42 | v59.36,38.43 v59.37,38.42 | v64.44,38.43 v64.45,38.42 | v66.98,33.35 v66.99,33.34 | v61.9,33.35 v61.91,33.34 | v56.82,33.35 v56.83,33.34 | v51.74,33.35 v51.75,33.34
  Top 0.508: U7.2 v8.89,30.48 | R4.1 v12.7,29.84 | R3.1 v22.86,29.84 | C8.2 v6.03,31.11 | U6.2 v19.05,30.48 | C7.2 v16.19,31.11 | R2.1 v33.02,29.84 | U5.2 v29.21,30.48 | C6.2 v26.35,31.11 | R1.1 v43.18,29.84 | U4.2 v39.37,30.48 | C5.2 v36.51,31.11 | C4.2 v15.88,22.23 | Q5.2 v49.2,38.43 | Q7.2 v54.28,38.43 | Q9.2 v59.36,38.43 | Q11.2 v64.44,38.43 | Q12.2 v66.98,33.35 | Q10.2 v61.9,33.35 | Q8.2 v56.82,33.35 | Q6.2 v51.74,33.35 | C12.2 v64.45,21.59 | J4.A1B12 8.66,18.49 v8.73,18.57 | J4.B1A12 8.66,11.99 v8.73,11.91 | C11.2 C13.2 11.17,15.3 | C9.2 C10.2 11.17,10.1 v11.11,10.16 | U9.1 11.84,17.08 v11.43,16.67 | DBG1.5 17.46,2.38 v16.99,1.91 | C15.2 v44.29,20.48 | C2.2 v40.01,15.88 | C1.2 v40.01,14.61 | R23.1 v7.3,21.59 | R22.1 v7.3,8.89
  pour Bottom (isolate 0.152): 0,50.8 80.64,50.8 80.64,0 0,0
I2C_SCL_3V3  (via drill 0.3)
  Top 0.152: v39.05,9.21 28.26,9.21 24.45,13.02 U10.17 | U8.26 61.34,15.31 60.64,14.61 51.75,14.61 50.8,13.65 R6.1 50.06,12.28 49.53,11.75 v49.53,8.57
  Bottom 0.152: v39.05,9.21 48.9,9.21 v49.53,8.57
I2C_SDA_3V3  (via drill 0.3)
  Top 0.152: U8.27 61.99,15.32 60.96,14.29 54.29,14.29 53.34,13.34 R5.1 52.6,12.28 52.07,11.75 v52.07,8.57 | v38.73,9.84 38.42,9.53 28.57,9.53 24.45,13.65 U10.18
  Bottom 0.152: v38.73,9.84 50.8,9.84 v52.07,8.57
LED1
  Top 0.152: 23.26,20.62 USER1.C
  Top 0.305: U10.24 23.26,20.62
N$1
  Top 0.406: Q1.1 42.93,36.45 43.18,36.2 R1.2 43.09,34.33 U4.4
N$2
  Top 0.406: Q3.1 22.61,36.45 22.86,36.2 R3.2 22.77,34.33 U6.4
N$3
  Top 0.406: U4.1 38.42,32.7 39.37,33.66 39.37,36.2 38.35,37.21 Q1.3
N$4
  Top 0.406: Q3.3 18.03,37.21 19.05,36.2 19.05,33.66 18.1,32.7 U6.1
N$5
  Top 0.406: Q4.1 12.45,36.45 12.7,36.2 R4.2 12.61,34.33 U7.4
N$6
  Top 0.406: Q4.3 7.87,37.85 8.89,36.83 8.89,33.66 7.94,32.7 U7.1
N$7
  Top 0.406: Q6.3 49.81,33.38 50.8,32.38 R9.2
N$8
  Top 0.406: Q7.3 52.35,37.5 53.34,36.51 R10.2
N$9
  Top 0.406: Q8.3 54.89,33.38 55.88,32.38 R12.2
N$10
  Top 0.406: Q2.1 32.77,36.45 33.02,36.2 R2.2 32.93,34.33 U5.4
N$11
  Top 0.406: Q9.3 57.43,37.5 58.42,36.51 R14.2
N$12
  Top 0.406: Q2.3 28.19,37.21 29.21,36.2 29.21,33.66 28.26,32.7 U5.1
N$13
  Top 0.406: Q10.3 59.97,33.38 60.96,32.38 R16.2
N$14
  Top 0.406: Q11.3 62.51,37.5 63.5,36.51 R18.2
N$15
  Top 0.406: Q12.3 65.05,33.38 66.04,32.38 R20.2
N$16
  Top 0.406: Q5.3 47.27,37.5 48.26,36.51 R8.2
N$17
  Top 0.406: R15.2 USER1.A
N$18
  Top 0.152: R22.2 4.55,13.12 4.92,13.49 J4.B5
N$19
  Top 0.152: R23.2 4.55,17.04 5.1,16.49 J4.A5
OUT0
  Top 0.406: 66.04,36.58 Q12.1 66.04,36.6 J3.8
  Bottom 0.406: D8.A J3.8
OUT1
  Top 0.406: 63.5,41.66 Q11.1 63.5,41.68 J3.7
  Bottom 0.406: D7.A J3.7
OUT1A
  Top 0.406: J1.2 37.31,45.24 40.64,41.91 Q1.2
OUT1B
  Top 0.406: J1.4 30.31,42.08 30.48,41.91 Q2.2
OUT2
  Top 0.406: 60.96,36.58 Q10.1 60.96,36.6 J3.6
  Bottom 0.406: D6.A J3.6
OUT2A
  Top 0.406: J2.2 16.99,45.24 20.32,41.91 Q3.2
OUT2B
  Top 0.406: J2.4 9.99,42.08 10.16,41.91 Q4.2
OUT3
  Top 0.406: 58.42,41.66 Q9.1 58.42,41.68 J3.5
  Bottom 0.406: D5.A J3.5
OUT4
  Top 0.406: 55.88,36.58 Q8.1 55.88,36.6 J3.4
  Bottom 0.406: D4.A J3.4
OUT5
  Top 0.406: 53.34,41.66 Q7.1 53.34,41.68 J3.3
  Bottom 0.406: D2.A J3.3
OUT6
  Top 0.406: J3.2 50.8,36.6 Q6.1
  Bottom 0.406: D1.A J3.2
OUT7
  Top 0.406: J3.1 48.26,41.68 Q5.1
  Bottom 0.406: D3.A J3.1
PWM0
  Top 0.305: U8.6 59.4,26.06 60.01,26.67 64.14,26.67 66.04,28.57 R20.1
PWM1
  Top 0.305: U8.7 58.74,26.36 59.69,27.3 62.23,27.3 63.5,28.57 R18.1
PWM2
  Top 0.305: U8.8 58.09,26.66 59.37,27.94 60.33,27.94 60.96,28.57 R16.1
PWM3
  Top 0.305: U8.9 57.45,26.96 58.42,27.94 R14.1
PWM4
  Top 0.305: U8.10 56.8,27.02 55.88,27.94 R12.1
PWM5
  Top 0.305: U8.11 56.15,26.72 54.93,27.94 53.98,27.94 53.34,28.57 R10.1
PWM6
  Top 0.305: U8.12 55.49,26.42 54.61,27.3 52.07,27.3 50.8,28.57 R9.1
PWM7
  Top 0.305: U8.13 54.84,26.12 54.29,26.67 50.16,26.67 48.26,28.57 R8.1
PWM_OE#_3V3  (via drill 0.3)
  Top 0.152: U8.23 59.4,15.9 58.42,14.92 49.53,14.92 48.26,13.65 R7.1 47.52,12.28 46.99,11.75 v46.99,8.57 | v38.73,8.57 38.42,8.89 27.94,8.89 24.45,12.38 U10.16
  Bottom 0.152: v38.73,8.57 v46.99,8.57
SPI1_CS_5V
  Top 0.152: U1.3 36.58,19.75 37.15,20.32 40.32,20.32 41.27,21.27 41.27,25.72 40.32,26.67 U2.3
SPI1_SCK_5V
  Top 0.152: U2.2 40.32,25.4 40.96,24.77 40.96,21.59 40.01,20.64 36.83,20.64 35.92,19.72 U1.4
SPI1_SDO_5V
  Top 0.152: U1.5 35.26,19.7 36.51,20.95 39.69,20.95 40.64,21.91 40.64,23.5 40.01,24.13 U2.1
SPI2_CS_5V
  Top 0.152: U3.3 19.05,26.67 20.32,25.4 24.77,25.4 28.89,21.27 32.07,21.27 33.96,19.38 U1.7
SPI2_SCK_5V
  Top 0.152: U3.2 19.05,25.4 19.68,24.77 24.77,24.77 28.57,20.95 31.75,20.95 33.33,19.38 U1.8
SPI2_SDO_5V
  Top 0.152: U3.1 24.77,24.13 28.26,20.64 31.43,20.64 32.66,19.41 U1.9
SPI_CS1_3V3
  Top 0.152: U1.21 35.92,10.2 35.56,9.84 28.89,9.84 24.45,14.29 U10.19
SPI_CS2_3V3
  Top 0.152: U1.17 33.33,10.46 33.02,10.16 29.21,10.16 24.45,14.92 U10.20
SPI_SCK_3V3
  Top 0.152: U10.23 32.7,16.83 | 32.7,16.83 34.92,16.83 35.26,16.5 U1.20 | U1.16 32.66,16.79 32.7,16.83
SPI_SDO_3V3  (via drill 0.3)
  Top 0.152: U1.15 32,10.79 | 32,10.79 32,10.73 31.75,10.48 29.53,10.48 24.45,15.56 U10.21 | U1.19 34.62,11.12 v34.29,10.79 | v32.7,10.79 32,10.79
  Bottom 0.152: v34.29,10.79 v32.7,10.79
SWCLK/TCK/C2CK
  Top 0.152: DBG1.4 16.19,5.71 16.51,6.03 19.68,6.03 20.8,4.92 20.8,4.29 21.27,3.81 R11.2 23.02,3.81 23.18,3.97 23.18,7.78 22.38,8.57 20.48,8.57 19.84,9.21 19.84,10.64 19.37,11.11 U10.11
SWDIO/TMS/C2D
  Top 0.152: DBG1.2 14.92,5.56 15.72,6.35 R13.2 22.38,6.41 22.38,7.62 21.75,8.26 20.32,8.26 19.53,9.05 19.53,10 19.12,10.4 17.94,10.4 U10.12

### Text on the board
_tsilk: J2 | J1 | J3 | 4 | 3 | 2 | 1 | 4 | 3 | 2 | 1 | 7 | 6 | 5 | 4 | 3 | 2 | 1 | 0 | +5V | 2B | +5V | 2A | +5V | 1B | +5V | 1A | +5V | Q5 | Q7 | Q9 | Q11 | Q4 | Q3 | Q2 | Q1 | R4 | R3 | R2 | R1 | Q6 | Q8 | Q10 | Q12 | C8 | C7 | C6 | C5 | U7 | U6 | U5 | U4 | R8 | R9 | R10 | R12 | R14 | R16 | R18 | R20 | * | * | U8 | U3 | U2 | R23 | C4 | C3 | R15 | USER1 | J4 | C12 | U10 | * | C15 | U9 | * | * | C2 | U1 | C13 | C11 | C1 | C10 | C9 | R7 | R6 | R5 | R22 | R13 | R11 | DBG1
_bsilk: D3 | D1 | D2 | D4 | D5 | D6 | D7 | D8